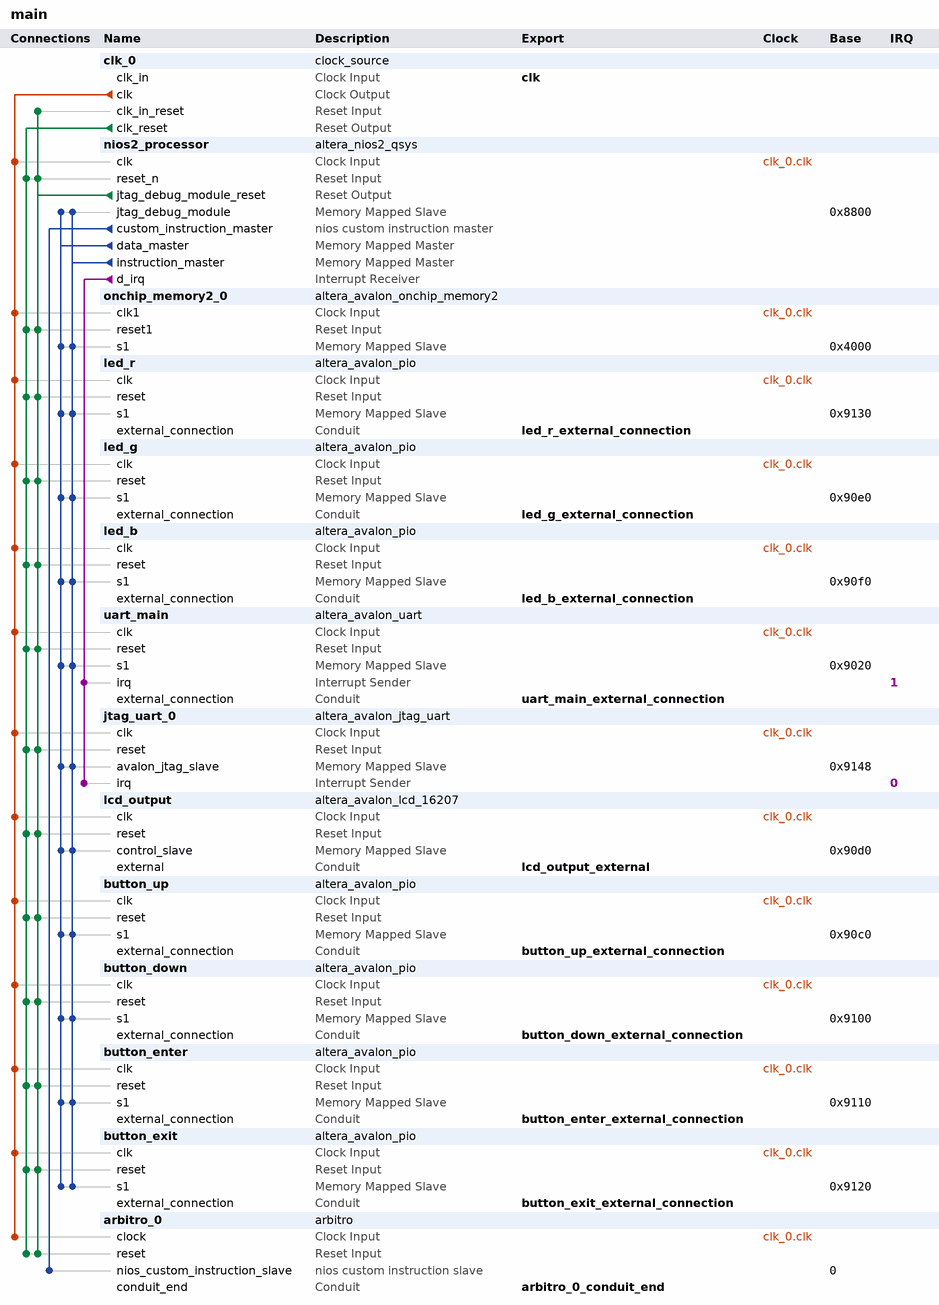
[diagram p0: system contents]
# Platform Designer (Qsys) system main, Cyclone IV E EP4CE30F23C7
# Parameters at their usual value, and those the tool derives, are not listed.
package require -exact qsys 18.1
create_system main
set_project_property DEVICE_FAMILY {Cyclone IV E}
set_project_property DEVICE EP4CE30F23C7

add_instance clk_0 clock_source 18.1
set_instance_parameter_value clk_0 clockFrequency 50000000

add_instance nios2_processor altera_nios2_qsys 16.1
set_instance_parameter_value nios2_processor breakSlave nios2_processor.jtag_debug_module
set_instance_parameter_value nios2_processor exceptionSlave onchip_memory2_0.s1
set_instance_parameter_value nios2_processor icache_size 4096
set_instance_parameter_value nios2_processor impl Tiny
set_instance_parameter_value nios2_processor mmu_TLBMissExcSlave None
set_instance_parameter_value nios2_processor resetSlave onchip_memory2_0.s1
set_instance_parameter_value nios2_processor resetrequest_enabled true

add_instance onchip_memory2_0 altera_avalon_onchip_memory2 18.1
set_instance_parameter_value onchip_memory2_0 dataWidth 32
set_instance_parameter_value onchip_memory2_0 dualPort false
set_instance_parameter_value onchip_memory2_0 initMemContent true
set_instance_parameter_value onchip_memory2_0 initializationFileName onchip_mem.hex
set_instance_parameter_value onchip_memory2_0 memorySize 16384

add_instance led_r altera_avalon_pio 18.1
set_instance_parameter_value led_r direction Output
set_instance_parameter_value led_r width 1

add_instance led_g altera_avalon_pio 18.1
set_instance_parameter_value led_g direction Output
set_instance_parameter_value led_g width 1

add_instance led_b altera_avalon_pio 18.1
set_instance_parameter_value led_b direction Output
set_instance_parameter_value led_b width 1

add_instance uart_main altera_avalon_uart 18.1
set_instance_parameter_value uart_main baud 115200
set_instance_parameter_value uart_main dataBits 8
set_instance_parameter_value uart_main fixedBaud true
set_instance_parameter_value uart_main parity NONE
set_instance_parameter_value uart_main stopBits 1

add_instance jtag_uart_0 altera_avalon_jtag_uart 18.1
set_instance_parameter_value jtag_uart_0 simInteractiveOptions NO_INTERACTIVE_WINDOWS

add_instance lcd_output altera_avalon_lcd_16207 18.1

add_instance button_up altera_avalon_pio 18.1
set_instance_parameter_value button_up direction Input
set_instance_parameter_value button_up width 1

add_instance button_down altera_avalon_pio 18.1
set_instance_parameter_value button_down direction Input
set_instance_parameter_value button_down width 1

add_instance button_enter altera_avalon_pio 18.1
set_instance_parameter_value button_enter direction Output
set_instance_parameter_value button_enter width 1

add_instance button_exit altera_avalon_pio 18.1
set_instance_parameter_value button_exit direction Input
set_instance_parameter_value button_exit width 1

add_instance arbitro_0 arbitro 1.0

# connections
add_connection clk_0.clk arbitro_0.clock clock
add_connection clk_0.clk button_down.clk clock
add_connection clk_0.clk button_enter.clk clock
add_connection clk_0.clk button_exit.clk clock
add_connection clk_0.clk button_up.clk clock
add_connection clk_0.clk jtag_uart_0.clk clock
add_connection clk_0.clk lcd_output.clk clock
add_connection clk_0.clk led_b.clk clock
add_connection clk_0.clk led_g.clk clock
add_connection clk_0.clk led_r.clk clock
add_connection clk_0.clk nios2_processor.clk clock
add_connection clk_0.clk onchip_memory2_0.clk1 clock
add_connection clk_0.clk uart_main.clk clock
add_connection clk_0.clk_reset arbitro_0.reset reset
add_connection clk_0.clk_reset button_down.reset reset
add_connection clk_0.clk_reset button_enter.reset reset
add_connection clk_0.clk_reset button_exit.reset reset
add_connection clk_0.clk_reset button_up.reset reset
add_connection clk_0.clk_reset jtag_uart_0.reset reset
add_connection clk_0.clk_reset lcd_output.reset reset
add_connection clk_0.clk_reset led_b.reset reset
add_connection clk_0.clk_reset led_g.reset reset
add_connection clk_0.clk_reset led_r.reset reset
add_connection clk_0.clk_reset nios2_processor.reset_n reset
add_connection clk_0.clk_reset onchip_memory2_0.reset1 reset
add_connection clk_0.clk_reset uart_main.reset reset
add_connection nios2_processor.jtag_debug_module_reset arbitro_0.reset reset
add_connection nios2_processor.jtag_debug_module_reset button_down.reset reset
add_connection nios2_processor.jtag_debug_module_reset button_enter.reset reset
add_connection nios2_processor.jtag_debug_module_reset button_exit.reset reset
add_connection nios2_processor.jtag_debug_module_reset button_up.reset reset
add_connection nios2_processor.jtag_debug_module_reset clk_0.clk_in_reset reset
add_connection nios2_processor.jtag_debug_module_reset jtag_uart_0.reset reset
add_connection nios2_processor.jtag_debug_module_reset lcd_output.reset reset
add_connection nios2_processor.jtag_debug_module_reset led_b.reset reset
add_connection nios2_processor.jtag_debug_module_reset led_g.reset reset
add_connection nios2_processor.jtag_debug_module_reset led_r.reset reset
add_connection nios2_processor.jtag_debug_module_reset nios2_processor.reset_n reset
add_connection nios2_processor.jtag_debug_module_reset onchip_memory2_0.reset1 reset
add_connection nios2_processor.jtag_debug_module_reset uart_main.reset reset
add_connection nios2_processor.data_master button_down.s1 avalon
set_connection_parameter_value nios2_processor.data_master/button_down.s1 baseAddress 0x9100
add_connection nios2_processor.data_master button_enter.s1 avalon
set_connection_parameter_value nios2_processor.data_master/button_enter.s1 baseAddress 0x9110
add_connection nios2_processor.data_master button_exit.s1 avalon
set_connection_parameter_value nios2_processor.data_master/button_exit.s1 baseAddress 0x9120
add_connection nios2_processor.data_master button_up.s1 avalon
set_connection_parameter_value nios2_processor.data_master/button_up.s1 baseAddress 0x90c0
add_connection nios2_processor.data_master jtag_uart_0.avalon_jtag_slave avalon
set_connection_parameter_value nios2_processor.data_master/jtag_uart_0.avalon_jtag_slave baseAddress 0x9148
add_connection nios2_processor.data_master lcd_output.control_slave avalon
set_connection_parameter_value nios2_processor.data_master/lcd_output.control_slave baseAddress 0x90d0
add_connection nios2_processor.data_master led_b.s1 avalon
set_connection_parameter_value nios2_processor.data_master/led_b.s1 baseAddress 0x90f0
add_connection nios2_processor.data_master led_g.s1 avalon
set_connection_parameter_value nios2_processor.data_master/led_g.s1 baseAddress 0x90e0
add_connection nios2_processor.data_master led_r.s1 avalon
set_connection_parameter_value nios2_processor.data_master/led_r.s1 baseAddress 0x9130
add_connection nios2_processor.data_master nios2_processor.jtag_debug_module avalon
set_connection_parameter_value nios2_processor.data_master/nios2_processor.jtag_debug_module baseAddress 0x8800
add_connection nios2_processor.data_master onchip_memory2_0.s1 avalon
set_connection_parameter_value nios2_processor.data_master/onchip_memory2_0.s1 baseAddress 0x4000
add_connection nios2_processor.data_master uart_main.s1 avalon
set_connection_parameter_value nios2_processor.data_master/uart_main.s1 baseAddress 0x9020
add_connection nios2_processor.instruction_master button_down.s1 avalon
set_connection_parameter_value nios2_processor.instruction_master/button_down.s1 baseAddress 0x9100
add_connection nios2_processor.instruction_master button_enter.s1 avalon
set_connection_parameter_value nios2_processor.instruction_master/button_enter.s1 baseAddress 0x9110
add_connection nios2_processor.instruction_master button_exit.s1 avalon
set_connection_parameter_value nios2_processor.instruction_master/button_exit.s1 baseAddress 0x9120
add_connection nios2_processor.instruction_master button_up.s1 avalon
set_connection_parameter_value nios2_processor.instruction_master/button_up.s1 baseAddress 0x90c0
add_connection nios2_processor.instruction_master jtag_uart_0.avalon_jtag_slave avalon
set_connection_parameter_value nios2_processor.instruction_master/jtag_uart_0.avalon_jtag_slave baseAddress 0x9148
add_connection nios2_processor.instruction_master lcd_output.control_slave avalon
set_connection_parameter_value nios2_processor.instruction_master/lcd_output.control_slave baseAddress 0x90d0
add_connection nios2_processor.instruction_master led_b.s1 avalon
set_connection_parameter_value nios2_processor.instruction_master/led_b.s1 baseAddress 0x90f0
add_connection nios2_processor.instruction_master led_g.s1 avalon
set_connection_parameter_value nios2_processor.instruction_master/led_g.s1 baseAddress 0x90e0
add_connection nios2_processor.instruction_master led_r.s1 avalon
set_connection_parameter_value nios2_processor.instruction_master/led_r.s1 baseAddress 0x9130
add_connection nios2_processor.instruction_master nios2_processor.jtag_debug_module avalon
set_connection_parameter_value nios2_processor.instruction_master/nios2_processor.jtag_debug_module baseAddress 0x8800
add_connection nios2_processor.instruction_master onchip_memory2_0.s1 avalon
set_connection_parameter_value nios2_processor.instruction_master/onchip_memory2_0.s1 baseAddress 0x4000
add_connection nios2_processor.instruction_master uart_main.s1 avalon
set_connection_parameter_value nios2_processor.instruction_master/uart_main.s1 baseAddress 0x9020
add_connection nios2_processor.d_irq jtag_uart_0.irq interrupt
set_connection_parameter_value nios2_processor.d_irq/jtag_uart_0.irq irqNumber 0
add_connection nios2_processor.d_irq uart_main.irq interrupt
set_connection_parameter_value nios2_processor.d_irq/uart_main.irq irqNumber 1
add_connection nios2_processor.custom_instruction_master arbitro_0.nios_custom_instruction_slave nios_custom_instruction
set_connection_parameter_value nios2_processor.custom_instruction_master/arbitro_0.nios_custom_instruction_slave CIName arbitro_0
set_connection_parameter_value nios2_processor.custom_instruction_master/arbitro_0.nios_custom_instruction_slave baseAddress 0

# exported interfaces
add_interface arbitro_0_conduit_end conduit end
set_interface_property arbitro_0_conduit_end EXPORT_OF arbitro_0.conduit_end
add_interface button_down_external_connection conduit end
set_interface_property button_down_external_connection EXPORT_OF button_down.external_connection
add_interface button_enter_external_connection conduit end
set_interface_property button_enter_external_connection EXPORT_OF button_enter.external_connection
add_interface button_exit_external_connection conduit end
set_interface_property button_exit_external_connection EXPORT_OF button_exit.external_connection
add_interface button_up_external_connection conduit end
set_interface_property button_up_external_connection EXPORT_OF button_up.external_connection
add_interface clk clock sink
set_interface_property clk EXPORT_OF clk_0.clk_in
add_interface lcd_output_external conduit end
set_interface_property lcd_output_external EXPORT_OF lcd_output.external
add_interface led_b_external_connection conduit end
set_interface_property led_b_external_connection EXPORT_OF led_b.external_connection
add_interface led_g_external_connection conduit end
set_interface_property led_g_external_connection EXPORT_OF led_g.external_connection
add_interface led_r_external_connection conduit end
set_interface_property led_r_external_connection EXPORT_OF led_r.external_connection
add_interface uart_main_external_connection conduit end
set_interface_property uart_main_external_connection EXPORT_OF uart_main.external_connection

set_interconnect_requirement {$system} qsys_mm.clockCrossingAdapter HANDSHAKE
set_interconnect_requirement {$system} qsys_mm.enableEccProtection FALSE
set_interconnect_requirement {$system} qsys_mm.insertDefaultSlave FALSE
set_interconnect_requirement {$system} qsys_mm.maxAdditionalLatency 1

save_system main.qsys
